# EAGLE schematic YMF_262 (EAGLE 7.3.0)
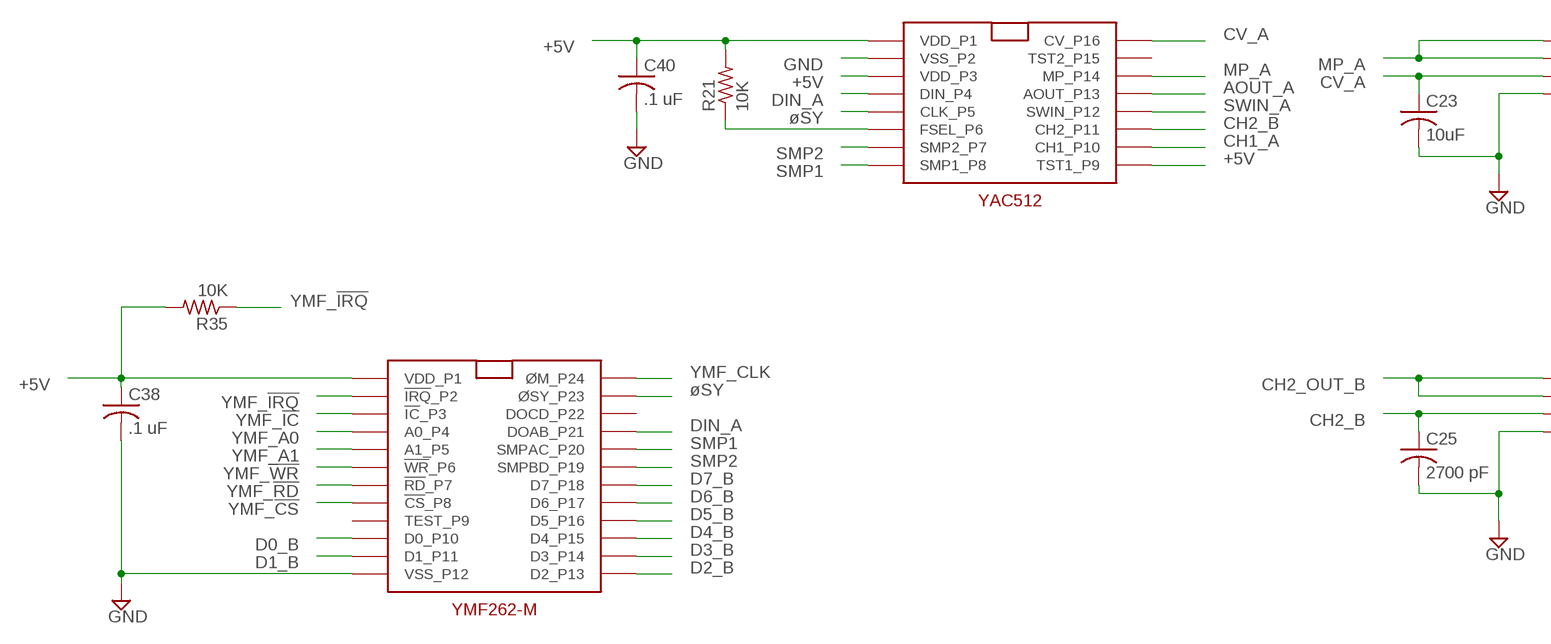
[diagram p0: schematic, sheet 1, part 1 of 2]
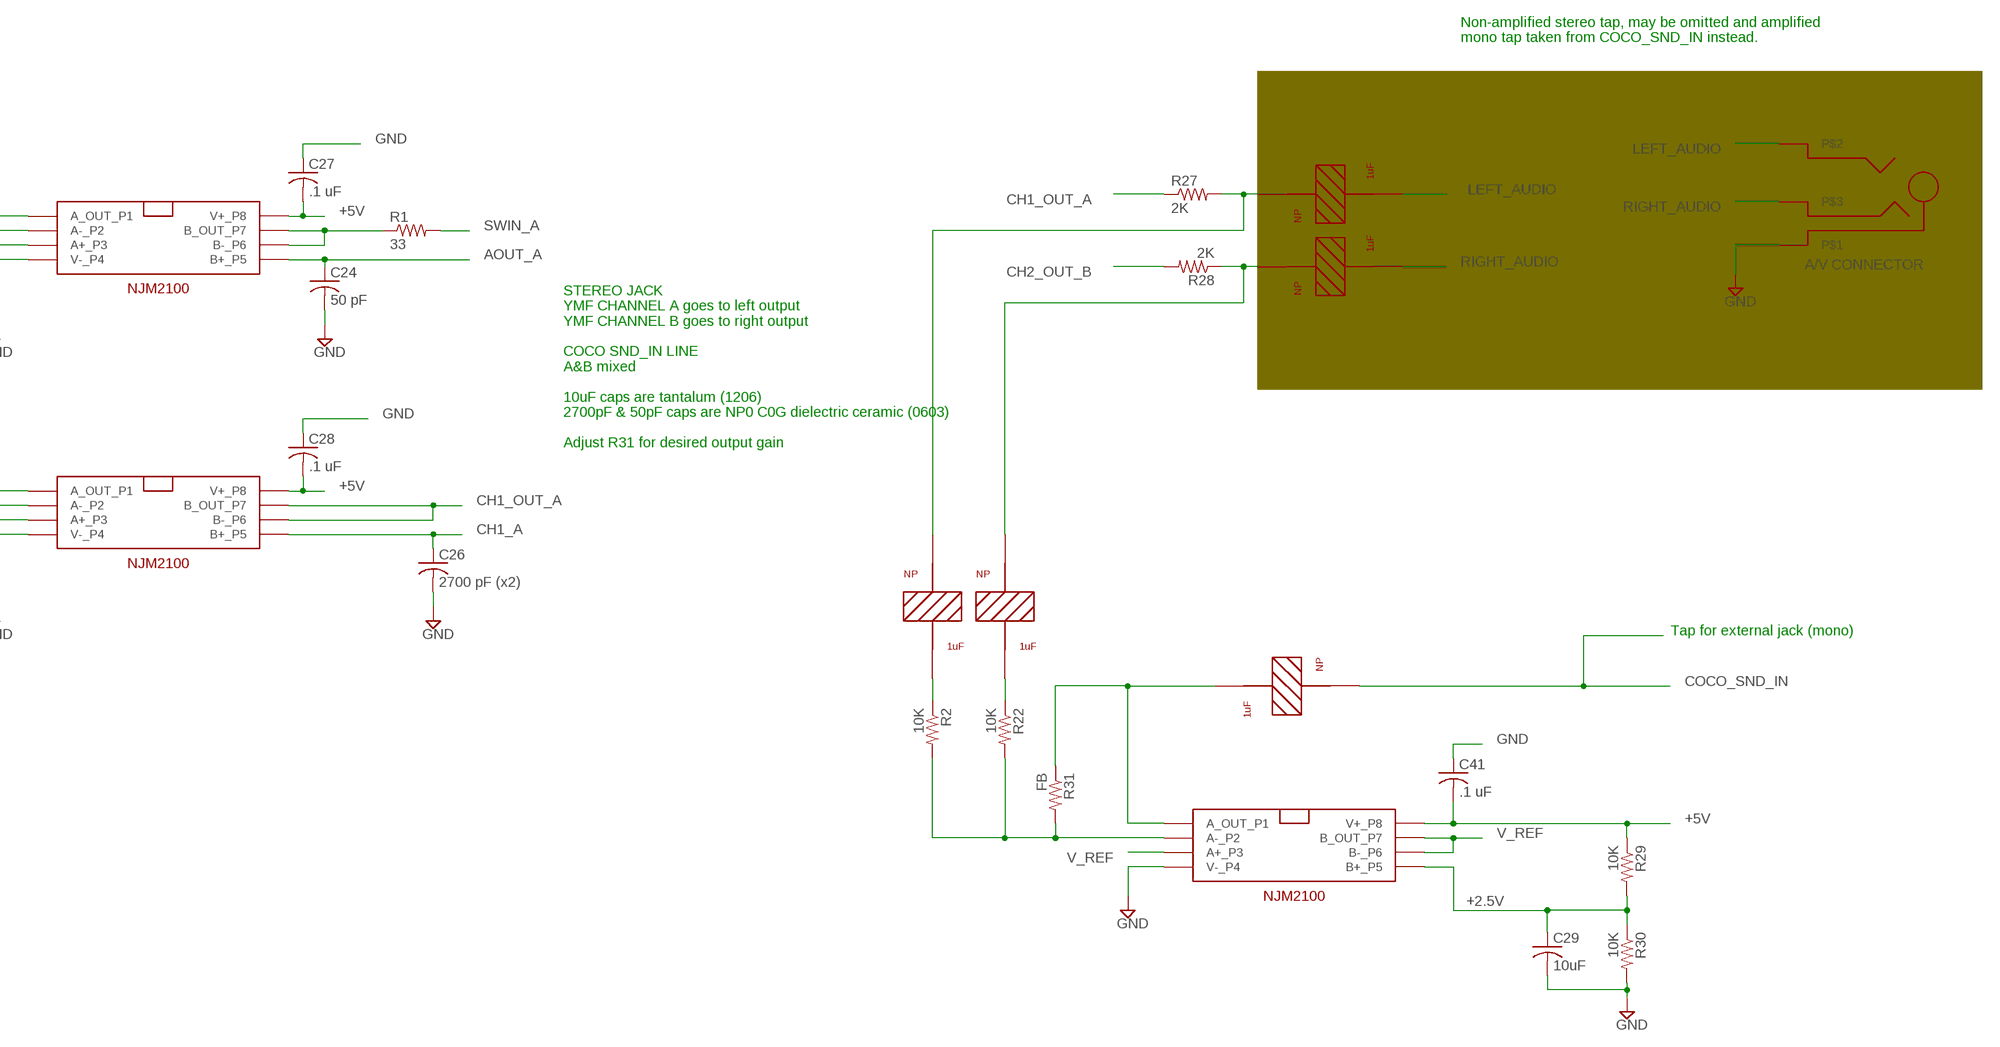
[diagram p1: schematic, sheet 1, part 2 of 2]

## Parts
C23  10uF  C-USC1206  [C1206]
C24  50 pF  C-USC0603K  [C0603K]
C25  2700 pF  C-USC0603K  [C0603K]
C26  2700 pF (x2)  C-USC0603K  [C0603K]
C27  .1 uF  C-USC0603K  [C0603K]
C28  .1 uF  C-USC0603K  [C0603K]
C29  10uF  C-USC1206  [C1206]
C38  .1 uF  C-USC0603K  [C0603K]
C40  .1 uF  C-USC0603K  [C0603K]
C41  .1 uF  C-USC0603K  [C0603K]
R1  33  R-US_R0805  [R0805]
R2  10K  R-US_R0805  [R0805]
R21  10K  R-US_M0805  [M0805]
R22  10K  R-US_R0805  [R0805]
R27  2K  R-US_R0805  [R0805]
R28  2K  R-US_R0805  [R0805]
R29  10K  R-US_R0805  [R0805]
R30  10K  R-US_R0805  [R0805]
R31  FB  R-US_R0805  [R0805]
R35  10K  R-US_M0805  [M0805]
U$1  1uF  NICHICON_SMT_CAP_4MM_NP  [NICHICON_SMT_CAP_4MM_NP]
U$2  CUI-3543N  [CUI-3543N]
U$3  1uF  NICHICON_SMT_CAP_4MM_NP  [NICHICON_SMT_CAP_4MM_NP]
U$15  YMF262_M  [YMF262_M]
U$18  YAC512  [YAC512]
U$19  NJM2100_SSOP8  [NJM2100_SSOP8]
U$20  NJM2100_SSOP8  [NJM2100_SSOP8]
U$21  1uF  NICHICON_SMT_CAP_4MM_NP  [NICHICON_SMT_CAP_4MM_NP]
U$25  NJM2100_SSOP8  [NJM2100_SSOP8]
U$26  1uF  NICHICON_SMT_CAP_4MM_NP  [NICHICON_SMT_CAP_4MM_NP]
U$27  1uF  NICHICON_SMT_CAP_4MM_NP  [NICHICON_SMT_CAP_4MM_NP]

## Nets
+2.5V: C29.1 R29.2 R30.1 U$25.P$5(B+_P5)
+5V: C27.2 C28.2 C38.1 C40.1 C41.2 R21.2 R29.1 R35.2 U$15.P$1(VDD_P1) U$18.P$1(VDD_P1) U$18.P$3(VDD_P3) U$18.P$9(TST1_P9) U$19.P$8(V+_P8) U$20.P$8(V+_P8) U$25.P$8(V+_P8)
AOUT_A: C24.1 U$18.P$13(AOUT_P13) U$19.P$5(B+_P5)
CH1_A: C26.1 U$18.P$10(CH1_P10) U$20.P$5(B+_P5)
CH1_OUT_A: R27.1 U$20.P$6(B-_P6) U$20.P$7(B_OUT_P7)
CH2_B: C25.1 U$18.P$11(CH2_P11) U$20.P$3(A+_P3)
CH2_OUT_B: R28.2 U$20.P$1(A_OUT_P1) U$20.P$2(A-_P2)
COCO_SND_IN: U$1.P$1
CV_A: C23.1 U$18.P$16(CV_P16) U$19.P$3(A+_P3)
D0_B: U$15.P$10(D0_P10)
D1_B: U$15.P$11(D1_P11)
D2_B: U$15.P$13(D2_P13)
D3_B: U$15.P$14(D3_P14)
D4_B: U$15.P$15(D4_P15)
D5_B: U$15.P$16(D5_P16)
D6_B: U$15.P$17(D6_P17)
D7_B: U$15.P$18(D7_P18)
DIN_A: U$15.P$21(DOAB_P21) U$18.P$4(DIN_P4)
GND: C23.2 C24.2 C25.2 C26.2 C27.1 C28.1 C29.2 C38.2 C40.2 C41.1 R30.2 U$2.1 U$15.P$12(VSS_P12) U$18.P$2(VSS_P2) U$19.P$4(V-_P4) U$20.P$4(V-_P4) U$25.P$4(V-_P4)
LEFT_AUDIO: U$2.2 U$26.P$2
MP_A: U$18.P$14(MP_P14) U$19.P$1(A_OUT_P1) U$19.P$2(A-_P2)
N$1: R1.1 U$19.P$6(B-_P6) U$19.P$7(B_OUT_P7)
N$9: R28.1 U$21.P$1 U$27.P$1
N$15: R21.1 U$18.P$6(FSEL_P6)
N$16: R2.1 U$3.P$2
N$17: R22.1 U$21.P$2
N$18: R27.2 U$3.P$1 U$26.P$1
N$19: R2.2 R22.2 R31.2 U$25.P$2(A-_P2)
RIGHT_AUDIO: U$2.3 U$27.P$2
SMP1: U$15.P$20(SMPAC_P20) U$18.P$8(SMP1_P8)
SMP2: U$15.P$19(SMPBD_P19) U$18.P$7(SMP2_P7)
SWIN_A: R1.2 U$18.P$12(SWIN_P12)
V_REF: U$25.P$3(A+_P3) U$25.P$6(B-_P6) U$25.P$7(B_OUT_P7)
YM_262_OUT: R31.1 U$1.P$2 U$25.P$1(A_OUT_P1)
YMF_!CS: U$15.P$8(!CS!_P8)
YMF_!IC: U$15.P$3(!IC!_P3)
YMF_!IRQ: R35.1 U$15.P$2(!IRQ!_P2)
YMF_!RD: U$15.P$7(!RD!_P7)
YMF_!WR: U$15.P$6(!WR!_P6)
YMF_A0: U$15.P$4(A0_P4)
YMF_A1: U$15.P$5(A1_P5)
YMF_CLK: U$15.P$24(ØM_P24)
øSY: U$15.P$23(ØSY_P23) U$18.P$5(CLK_P5)
Unconnected: U$15.P$9(TEST_P9) U$15.P$22(DOCD_P22) U$18.P$15(TST2_P15)

## Notes on the sheet
- Non-amplified stereo tap, may be omitted and amplified
  mono tap taken from COCO_SND_IN instead.
- STEREO JACK
  YMF CHANNEL A goes to left output
  YMF CHANNEL B goes to right output
  
  COCO SND_IN LINE
  A&B mixed
  
  10uF caps are tantalum (1206)
  2700pF & 50pF caps are NP0 C0G dielectric ceramic (0603)
  
  Adjust R31 for desired output gain
- Tap for external jack (mono)

## Library data of the parts
C23-C29 C38 C40 C41 = resistor:C-US: CAPACITOR, American symbol
R1 R2 R21 R22 R27-R31 R35 = resistor:R-US_: RESISTOR, American symbol
U$1 U$3 U$21 U$26 U$27 = Zippster's Parts:NICHICON_SMT_CAP_4MM_NP
U$2 = Zippster's Parts:CUI-3543N
U$15 = Zippster's Parts:YMF262_M
U$18 = Zippster's Parts:YAC512
U$19 U$20 U$25 = Zippster's Parts:NJM2100_SSOP8